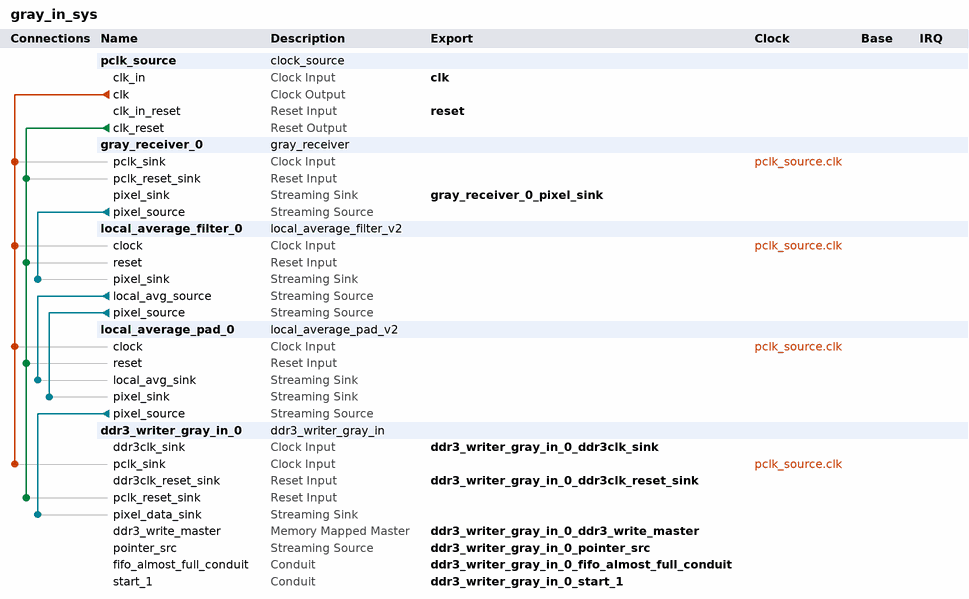
[diagram p0: system contents]
# Platform Designer (Qsys) system gray_in_sys, Cyclone V 5CSEBA6U23I7
# Parameters at their usual value, and those the tool derives, are not listed.
package require -exact qsys 18.1
create_system gray_in_sys
set_project_property DEVICE_FAMILY {Cyclone V}
set_project_property DEVICE 5CSEBA6U23I7

add_instance pclk_source clock_source 18.1
set_instance_parameter_value pclk_source clockFrequency 50000000

add_instance gray_receiver_0 gray_receiver 1.0
set_instance_parameter_value gray_receiver_0 frame_lines 480
set_instance_parameter_value gray_receiver_0 frame_width 768

add_instance local_average_filter_0 local_average_filter_v2 1.0
set_instance_parameter_value local_average_filter_0 radius 8

add_instance local_average_pad_0 local_average_pad_v2 1.0
set_instance_parameter_value local_average_pad_0 frame_lines 480
set_instance_parameter_value local_average_pad_0 frame_width 768
set_instance_parameter_value local_average_pad_0 radius 8

add_instance ddr3_writer_gray_in_0 ddr3_writer_gray_in 1.0
set_instance_parameter_value ddr3_writer_gray_in_0 burst_len 8
set_instance_parameter_value ddr3_writer_gray_in_0 in_width 16
set_instance_parameter_value ddr3_writer_gray_in_0 rotate_buffers 0

# connections
add_connection pclk_source.clk ddr3_writer_gray_in_0.pclk_sink clock
add_connection pclk_source.clk gray_receiver_0.pclk_sink clock
add_connection pclk_source.clk local_average_filter_0.clock clock
add_connection pclk_source.clk local_average_pad_0.clock clock
add_connection pclk_source.clk_reset ddr3_writer_gray_in_0.pclk_reset_sink reset
add_connection pclk_source.clk_reset gray_receiver_0.pclk_reset_sink reset
add_connection pclk_source.clk_reset local_average_filter_0.reset reset
add_connection pclk_source.clk_reset local_average_pad_0.reset reset
add_connection gray_receiver_0.pixel_source local_average_filter_0.pixel_sink avalon_streaming
add_connection local_average_filter_0.local_avg_source local_average_pad_0.local_avg_sink avalon_streaming
add_connection local_average_filter_0.pixel_source local_average_pad_0.pixel_sink avalon_streaming
add_connection local_average_pad_0.pixel_source ddr3_writer_gray_in_0.pixel_data_sink avalon_streaming

# exported interfaces
add_interface clk clock sink
set_interface_property clk EXPORT_OF pclk_source.clk_in
add_interface ddr3_writer_gray_in_0_ddr3_write_master avalon master
set_interface_property ddr3_writer_gray_in_0_ddr3_write_master EXPORT_OF ddr3_writer_gray_in_0.ddr3_write_master
add_interface ddr3_writer_gray_in_0_ddr3clk_reset_sink reset sink
set_interface_property ddr3_writer_gray_in_0_ddr3clk_reset_sink EXPORT_OF ddr3_writer_gray_in_0.ddr3clk_reset_sink
add_interface ddr3_writer_gray_in_0_ddr3clk_sink clock sink
set_interface_property ddr3_writer_gray_in_0_ddr3clk_sink EXPORT_OF ddr3_writer_gray_in_0.ddr3clk_sink
add_interface ddr3_writer_gray_in_0_fifo_almost_full_conduit conduit end
set_interface_property ddr3_writer_gray_in_0_fifo_almost_full_conduit EXPORT_OF ddr3_writer_gray_in_0.fifo_almost_full_conduit
add_interface ddr3_writer_gray_in_0_pointer_src avalon_streaming source
set_interface_property ddr3_writer_gray_in_0_pointer_src EXPORT_OF ddr3_writer_gray_in_0.pointer_src
add_interface ddr3_writer_gray_in_0_start_1 conduit end
set_interface_property ddr3_writer_gray_in_0_start_1 EXPORT_OF ddr3_writer_gray_in_0.start_1
add_interface gray_receiver_0_pixel_sink avalon_streaming sink
set_interface_property gray_receiver_0_pixel_sink EXPORT_OF gray_receiver_0.pixel_sink
add_interface reset reset sink
set_interface_property reset EXPORT_OF pclk_source.clk_in_reset

set_interconnect_requirement {$system} qsys_mm.clockCrossingAdapter HANDSHAKE
set_interconnect_requirement {$system} qsys_mm.enableEccProtection FALSE
set_interconnect_requirement {$system} qsys_mm.insertDefaultSlave FALSE
set_interconnect_requirement {$system} qsys_mm.maxAdditionalLatency 1

save_system gray_in_sys.qsys
